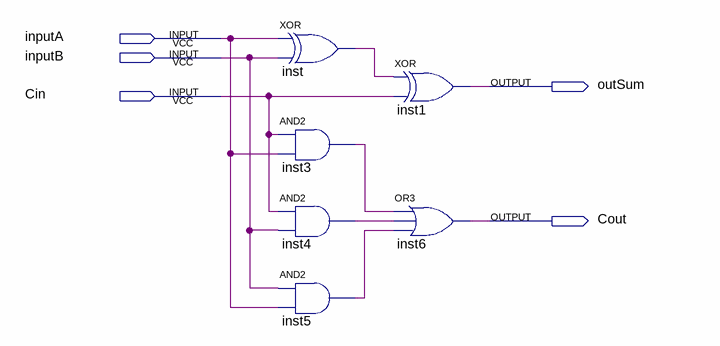
[diagram p0: schematic sheet]
// Quartus schematic FullAdder.bdf as structural Verilog: 6 symbols, 5 pins
module FullAdder (
  input  inputA,
  input  inputB,
  input  Cin,
  output outSum,
  output Cout
);

  wire inst3_out, inst4_out, inst5_out, inst_out;

  xor inst (inst_out, inputA, inputB);
  and inst3 (inst3_out, Cin, inputA);
  and inst4 (inst4_out, Cin, inputB);
  and inst5 (inst5_out, inputB, inputA);
  xor inst1 (outSum, inst_out, Cin);
  or inst6 (Cout, inst3_out, inst4_out, inst5_out);
endmodule
